# Altium schematic sheet ШЮГИ.468262.004 Э3 Л2.SchDoc
size 219 x 307 mm; Author: Вшивцев; Organization: 322; Address1: 3; Address2: 4; DocumentNumber: ШЮГИ.468262.004 Э3; SheetNumber: 2; SheetTotal: 2; PP: ШЮГИ.468262.004; TypeD: Схема электрическая принципиальная; VA: КИА; Name: Универсальный логгер для записи результатов измерений
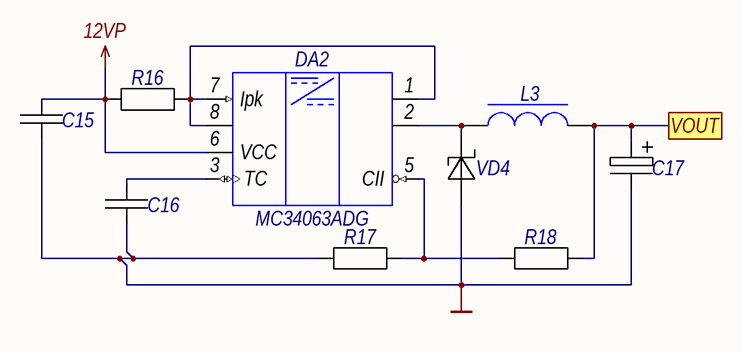
[diagram p0: ШЮГИ.468262.004 Э3 Л2.SchDoc]

## Parts
C15  0603B104J500CT Thunder  [C0603]  (value not drawn)
C16  0603B561J500CT Thunder  [C0603]  (value not drawn)
C17  JCK1C100M040054 JB Capacitors  [AL4X54]  (value not drawn)
DA2  MC34063ADG  [SO-8]
L3  CDRH74NP-101MC-B SUMIDA CORPORATION  [INDP7373X45N]  (value not drawn)
R16  CRL1206-FW-R220ELF Bourns  [R1206]  (value not drawn)
R17  Р1-12-0,25-1,21 кОм±2 %-Т-Л-М АБШК.434110.023 ТУ  [R1206]  (value not drawn)
R18  Р1-12-0,25-3,65 кОм±2 %-Т-Л-М АБШК.434110.023 ТУ  [R1206]  (value not drawn)
VD4  10MQ040 Sunmate Electronics  [DO-214AC]  (value not drawn)

## Ports
VOUT

## Nets
12VP: C15.1 DA2.6(VCC) R16.1(+)
GND: C15.2 C16.2 C17.2 DA2.4(GND) R17.1(+) VD4.1(AN)
VOUT: C17.1(+) L3.2 R18.2 ; port VOUT
NetC16_1: C16.1 DA2.3(TC)
NetDA2_1: DA2.1(C) DA2.7(Ipk) DA2.8(DC) R16.2
NetDA2_2: DA2.2(E) L3.1 VD4.2(CT)
NetDA2_5: DA2.5(CII) R17.2 R18.1(+)

## Notes on the sheet
- Лист
- Копировал
- Изм
- № докум.
- Подп.
- Дата
- Формат А4

## Library data of the parts
C15 = 0603B104J500CT: ТИП: Конденсатор; Value: 0,1 uF; Power: 50 V; Perk: ±5 %; Mark: 104; Диэлектрик: X7R; Part Number: 0603B104J500CT; ValueBOM: 0603B104J500CT Thunder; ValueSCH: 0603B104J500CT; ГОСТ: Thunder
C16 = 0603B561J500CT: ТИП: Конденсатор; Value: 560 pF; Power: 50 V; Perk: ±5 %; Mark: 561; Диэлектрик: X7R; Part Number: 0603B561J500CT; ValueBOM: 0603B561J500CT Thunder; ValueSCH: 0603B561J500CT; ГОСТ: Thunder
C17 = JCK1C100M040054: ТИП: Конденсатор; Value: 10 uF; Power: 16 V; Mark: 100; Part Number: JCK1C100M040054; ValueBOM: JCK1C100M040054 JB Capacitors; ValueSCH: JCK1C100M040054; ГОСТ: JB Capacitors
DA2 = MC34063ADG: ValueBOM: MC34063ADG ON Semiconductor; ГОСТ: ON Semiconductor; ТИП: Микросхема; Part Number: MC34063ADG; ValueSCH: MC34063ADG
L3 = CDRH74NP-101MC-B: Value: 100 uH; ТИП: Дроссель; Perc %: 20; Current A: 0,6; ValueSCH: CDRH74NP-101MC-B; ValueBOM: CDRH74NP-101MC-B SUMIDA CORPORATION; ГОСТ: SUMIDA CORPORATION; Part Number: CDRH74NP-101MC-B
R16 = CRL1206-FW-R220ELF: Value: 0,22 Ом; Perk: ±1%; Power: 0,25 Вт; ТИП: Резистор; Part Number: CRL1206-FW-R220ELF; ValueSCH: CRL1206-FW-R220ELF; ValueBOM: CRL1206-FW-R220ELF Bourns; ГОСТ: Bourns
R17 = Р1-12-0,25-1,21 кОм±2 %-Т-Л-М: ТИП: Резистор; Power: 0,25; Perk: ±2 %; Part Number: Р1-12-0,25-1,21 кОм±2 %-Т-Л-М; ValueBOM: Р1-12-0,25-1,21 кОм±2 %-Т-Л-М АБШК.434110.023 ТУ; ValueSCH: Р1-12-0,25-1,21 кОм±2 %-Т-Л-М; ГОСТ: АБШК.434110.023 ТУ; Value: 1,21 кОм
R18 = Р1-12-0,25-3,65 кОм±2 %-Т-Л-М: ТИП: Резистор; Power: 0,25; Perk: ±2 %; Part Number: Р1-12-0,25-3,65 кОм±2 %-Т-Л-М; ValueBOM: Р1-12-0,25-3,65 кОм±2 %-Т-Л-М АБШК.434110.023 ТУ; ValueSCH: Р1-12-0,25-3,65 кОм±2 %-Т-Л-М; ГОСТ: АБШК.434110.023 ТУ; Value: 3,65 кОм
VD4 = 10MQ040: Диод Шоттки; Ur: 40; Uf: 0,5; Part Number: 10MQ040; ValueSCH: 10MQ040; ValueBOM: 10MQ040 Sunmate Electronics; ГОСТ: Sunmate Electronics; ТИП: Диод Шоттки